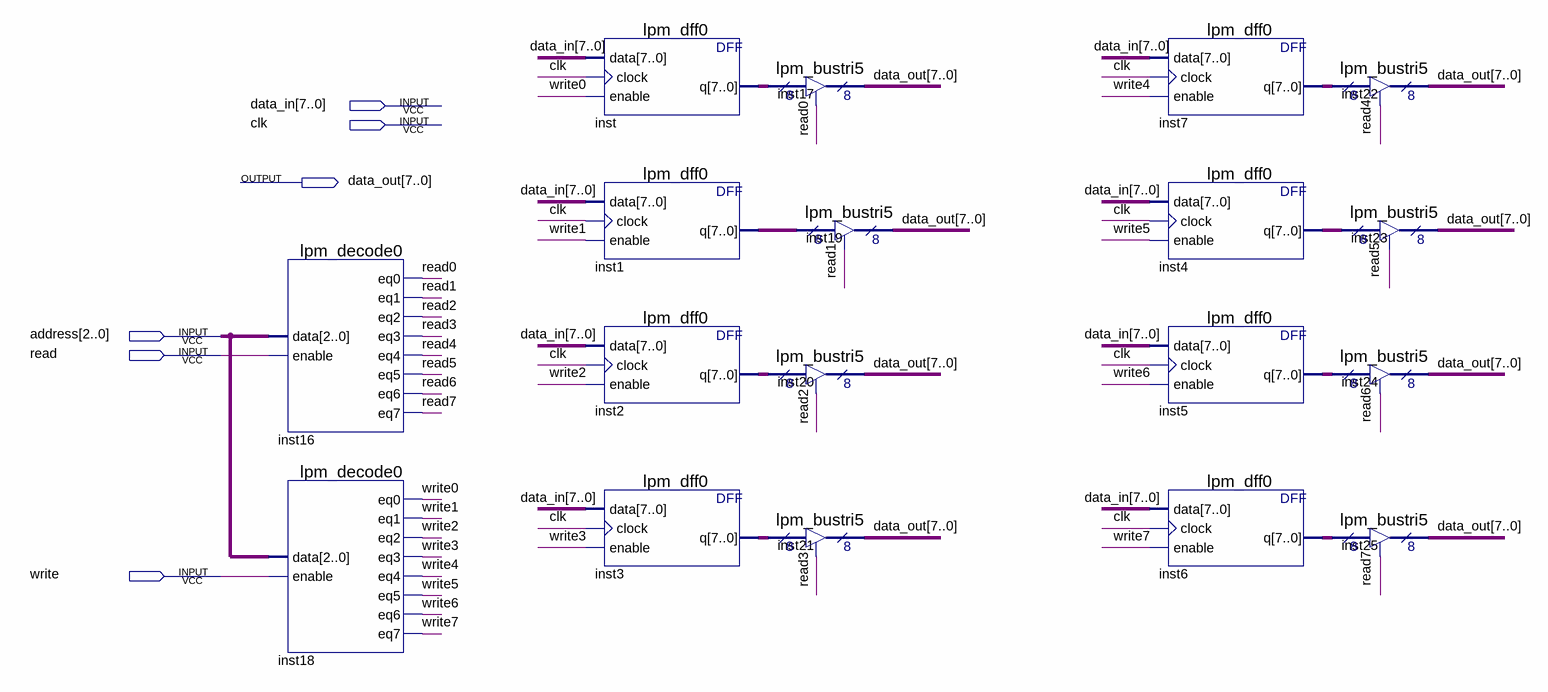
[diagram p0: schematic sheet]
// Quartus schematic cache_line.bdf as structural Verilog: 18 symbols, 6 pins
module cache_line (
  input  [7:0] data_in,
  input  clk,
  input  [2:0] address,
  input  read,
  input  write,
  output [7:0] data_out
);

  wire read0, read1, read2, read3, read4, read5, read6, read7, write0, write1, write2, write3, write4,
       write5, write6, write7;
  wire [7:0] inst1_q, inst2_q, inst3_q, inst4_q, inst5_q, inst6_q, inst7_q, inst_q;

  lpm_decode0 inst16 (
    .data(address), .enable(read), .eq0(read0), .eq1(read1), .eq2(read2), .eq3(read3), .eq4(read4),
    .eq5(read5), .eq6(read6), .eq7(read7));
  lpm_decode0 inst18 (
    .data(address), .enable(write), .eq0(write0), .eq1(write1), .eq2(write2), .eq3(write3), .eq4(write4),
    .eq5(write5), .eq6(write6), .eq7(write7));
  lpm_dff0 inst (.data(data_in), .clock(clk), .enable(write0), .q(inst_q));
  lpm_dff0 inst1 (.data(data_in), .clock(clk), .enable(write1), .q(inst1_q));
  lpm_dff0 inst2 (.data(data_in), .clock(clk), .enable(write2), .q(inst2_q));
  lpm_dff0 inst3 (.data(data_in), .clock(clk), .enable(write3), .q(inst3_q));
  lpm_bustri5 inst17 (.enabledt(read0), .data(inst_q), .tridata(data_out));
  lpm_bustri5 inst19 (.enabledt(read1), .data(inst1_q), .tridata(data_out));
  lpm_bustri5 inst20 (.enabledt(read2), .data(inst2_q), .tridata(data_out));
  lpm_bustri5 inst21 (.enabledt(read3), .data(inst3_q), .tridata(data_out));
  lpm_dff0 inst7 (.data(data_in), .clock(clk), .enable(write4), .q(inst7_q));
  lpm_dff0 inst4 (.data(data_in), .clock(clk), .enable(write5), .q(inst4_q));
  lpm_dff0 inst5 (.data(data_in), .clock(clk), .enable(write6), .q(inst5_q));
  lpm_dff0 inst6 (.data(data_in), .clock(clk), .enable(write7), .q(inst6_q));
  lpm_bustri5 inst22 (.enabledt(read4), .data(inst7_q), .tridata(data_out));
  lpm_bustri5 inst23 (.enabledt(read5), .data(inst4_q), .tridata(data_out));
  lpm_bustri5 inst24 (.enabledt(read6), .data(inst5_q), .tridata(data_out));
  lpm_bustri5 inst25 (.enabledt(read7), .data(inst6_q), .tridata(data_out));
endmodule
